# EAGLE design laser-tag (EAGLE 6.6.0)
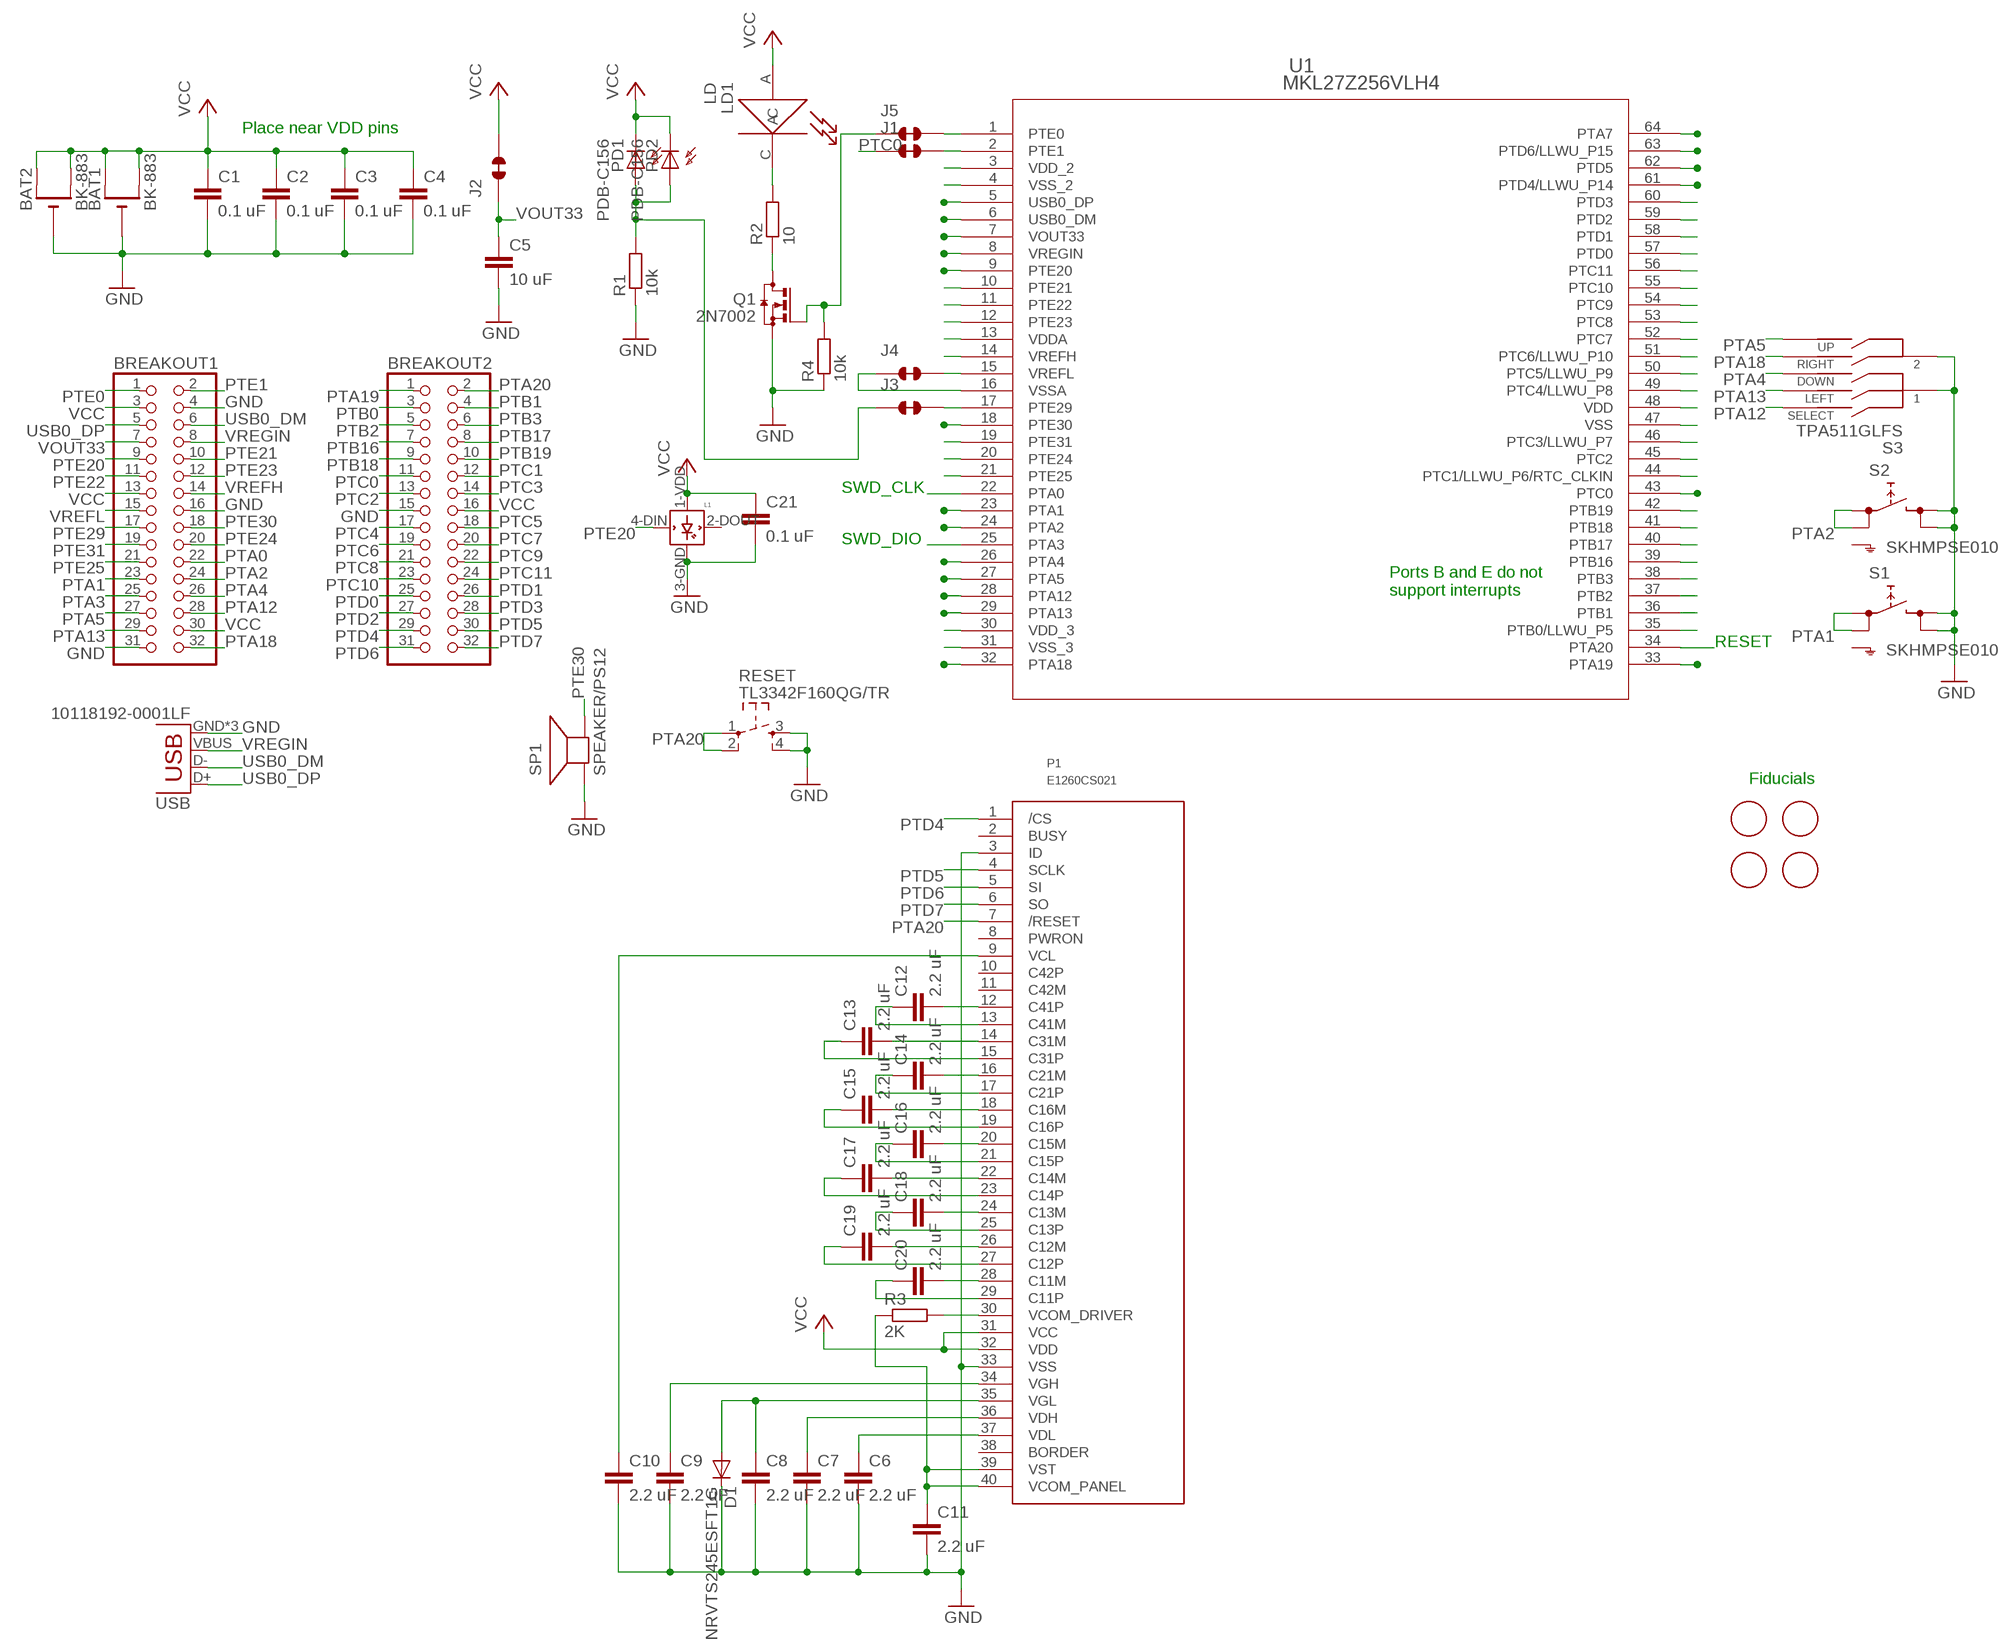
[diagram p0: schematic, sheet 1]

## Parts
BAT1  BK-883  CR2032SMT  [CR2032-SMD]
BAT2  BK-883  CR2032SMT  [CR2032-SMD]
BREAKOUT1  PINHD-2X16  [2X16]
BREAKOUT2  PINHD-2X16  [2X16]
C1  0.1 uF  C-EUC0603K  [C0603K]
C2  0.1 uF  C-EUC0603K  [C0603K]
C3  0.1 uF  C-EUC0603K  [C0603K]
C4  0.1 uF  C-EUC0603K  [C0603K]
C5  10 uF  C-EUC0603K  [C0603K]
C6  2.2 uF  C-EUC0603K  [C0603K]
C7  2.2 uF  C-EUC0603K  [C0603K]
C8  2.2 uF  C-EUC0603K  [C0603K]
C9  2.2 uF  C-EUC0603K  [C0603K]
C10  2.2 uF  C-EUC0603K  [C0603K]
C11  2.2 uF  C-EUC0603K  [C0603K]
C12  2.2 uF  C-EUC0603K  [C0603K]
C13  2.2 uF  C-EUC0603K  [C0603K]
C14  2.2 uF  C-EUC0603K  [C0603K]
C15  2.2 uF  C-EUC0603K  [C0603K]
C16  2.2 uF  C-EUC0603K  [C0603K]
C17  2.2 uF  C-EUC0603K  [C0603K]
C18  2.2 uF  C-EUC0603K  [C0603K]
C19  2.2 uF  C-EUC0603K  [C0603K]
C20  2.2 uF  C-EUC0603K  [C0603K]
C21  0.1 uF  C-EUC0603K  [C0603K]
D1  NRVTS245ESFT1G  CGRM4001-G  [SOD-123_MINI-SMA]
J1  JUMPER_SOLDER_1X2_CLOSED  [JUMPER_SOLDER_1X2_CLOSED]
J2  JUMPER_SOLDER_1X2_CLOSED  [JUMPER_SOLDER_1X2_CLOSED]
J3  JUMPER_SOLDER_1X2_CLOSED  [JUMPER_SOLDER_1X2_CLOSED]
J4  JUMPER_SOLDER_1X2_CLOSED  [JUMPER_SOLDER_1X2_CLOSED]
J5  JUMPER_SOLDER_1X2_CLOSED  [JUMPER_SOLDER_1X2_CLOSED]
L1  WS2812B  [WS2812B]
LD1  LD  [LD-FLUSH-WITH-JUMPER]
P1  E1260CS021  [E1260CS021_SLOT]
PD1  PDB-C156  [PDB-C156-FLUSH]
PD2  PDB-C156  [PDB-C156-FLUSH]
Q1  2N7002  BSS123  [SOT23]
R1  10k  R-EU_R0603  [R0603]
R2  10  R-EU_R0603  [R0603]
R3  2K  R-EU_R0603  [R0603]
R4  10k  R-EU_R0603  [R0603]
RESET  TL3342F160QG/TR  SW_TACT_4P  [SW_TACT_SMALL]
S1  SKHMPSE010  [SKHMPXE010]
S2  SKHMPSE010  [SKHMPXE010]
S3  TPA511GLFS  [TPA511GLFS]
SP1  SPEAKER/PS12  [PS12]
U1  MKL27Z256VLH4  [LQFP-64_10X10X1.6]
U$1  FIDUCIAL  [FIDUCIAL_1MM]
U$2  FIDUCIAL  [FIDUCIAL_1MM]
U$3  FIDUCIAL  [FIDUCIAL_1MM]
U$4  FIDUCIAL  [FIDUCIAL_1MM]
USB  10118192-0001LF  USB-MICROB  [USB-MICROB]

## Nets
GND: BAT1.- BAT2.- BREAKOUT1.4 BREAKOUT1.16 BREAKOUT1.31 BREAKOUT2.15 C1.2 C2.2 C3.2 C4.2 C5.2 C6.2 C7.2 C8.2 C9.2 C10.2 C11.2 C21.2 D1.C J4.1 L1.3-GND(GND) P1.3(ID) P1.33(VSS) Q1.2(S) R1.1 R4.1 RESET.3 RESET.4 S1.3(2.1) S1.4(2.2) S2.3(2.1) S2.4(2.2) S3.1 S3.2 SP1.P$1(+) U1.4(VSS_2) U1.16(VSSA) U1.31(VSS_3) U1.47(VSS) USB.GND USB.MT1(GND) USB.MT2(GND)
N$1: Q1.3(D) R2.1
N$2: C11.1 P1.39(VST) P1.40(VCOM_PANEL) R3.1
N$3: P1.30(VCOM_DRIVER) R3.2
N$4: C6.1 P1.37(VDL)
N$5: C7.1 P1.36(VDH)
N$6: C8.1 D1.A P1.35(VGL)
N$7: C9.1 P1.34(VGH)
N$8: C10.1 P1.9(VCL)
N$9: LD1.C R2.2
N$10: J5.1 Q1.1(G) R4.2
N$11: J3.1 PD1.A PD2.A R1.2
N$12: C12.2 P1.12(C41P)
N$13: C12.1 P1.13(C41M)
N$14: C13.2 P1.14(C31M)
N$15: C13.1 P1.15(C31P)
N$16: C14.2 P1.16(C21M)
N$17: C14.1 P1.17(C21P)
N$18: C15.2 P1.18(C16M)
N$19: C15.1 P1.19(C16P)
N$20: C16.2 P1.20(C15M)
N$21: C16.1 P1.21(C15P)
N$22: C17.2 P1.22(C14M)
N$23: C17.1 P1.23(C14P)
N$24: C18.2 P1.24(C13M)
N$25: C18.1 P1.25(C13P)
N$26: C19.2 P1.26(C12M)
N$27: C19.1 P1.27(C12P)
N$28: C20.2 P1.28(C11M)
N$29: C20.1 P1.29(C11P)
PTA0: BREAKOUT1.22 U1.22(PTA0)
PTA1: BREAKOUT1.23 S1.1(1.1) S1.2(1.2) U1.23(PTA1)
PTA2: BREAKOUT1.24 S2.1(1.1) S2.2(1.2) U1.24(PTA2)
PTA3: BREAKOUT1.25 U1.25(PTA3)
PTA4: BREAKOUT1.26 S3.4(DOWN) U1.26(PTA4)
PTA5: BREAKOUT1.27 S3.3(UP) U1.27(PTA5)
PTA12: BREAKOUT1.28 S3.5(SELECT) U1.28(PTA12)
PTA13: BREAKOUT1.29 S3.7(LEFT) U1.29(PTA13)
PTA18: BREAKOUT1.32 S3.6(RIGHT) U1.32(PTA18)
PTA19: BREAKOUT2.1 U1.33(PTA19)
PTA20: BREAKOUT2.2 P1.7(/RESET) RESET.1 RESET.2 U1.34(PTA20)
PTB0: BREAKOUT2.3 U1.35(PTB0/LLWU_P5)
PTB1: BREAKOUT2.4 U1.36(PTB1)
PTB2: BREAKOUT2.5 U1.37(PTB2)
PTB3: BREAKOUT2.6 U1.38(PTB3)
PTB16: BREAKOUT2.7 U1.39(PTB16)
PTB17: BREAKOUT2.8 U1.40(PTB17)
PTB18: BREAKOUT2.9 U1.41(PTB18)
PTB19: BREAKOUT2.10 U1.42(PTB19)
PTC0: BREAKOUT2.11 J1.1 U1.43(PTC0)
PTC1: BREAKOUT2.12 U1.44(PTC1/LLWU_P6/RTC_CLKIN)
PTC2: BREAKOUT2.13 U1.45(PTC2)
PTC3: BREAKOUT2.14 U1.46(PTC3/LLWU_P7)
PTC4: BREAKOUT2.17 U1.49(PTC4/LLWU_P8)
PTC5: BREAKOUT2.18 U1.50(PTC5/LLWU_P9)
PTC6: BREAKOUT2.19 U1.51(PTC6/LLWU_P10)
PTC7: BREAKOUT2.20 U1.52(PTC7)
PTC8: BREAKOUT2.21 U1.53(PTC8)
PTC9: BREAKOUT2.22 U1.54(PTC9)
PTC10: BREAKOUT2.23 U1.55(PTC10)
PTC11: BREAKOUT2.24 U1.56(PTC11)
PTD0: BREAKOUT2.25 U1.57(PTD0)
PTD1: BREAKOUT2.26 U1.58(PTD1)
PTD2: BREAKOUT2.27 U1.59(PTD2)
PTD3: BREAKOUT2.28 U1.60(PTD3)
PTD4: BREAKOUT2.29 P1.1(/CS) U1.61(PTD4/LLWU_P14)
PTD5: BREAKOUT2.30 P1.4(SCLK) U1.62(PTD5)
PTD6: BREAKOUT2.31 P1.5(SI) U1.63(PTD6/LLWU_P15)
PTD7: BREAKOUT2.32 P1.6(SO) U1.64(PTA7)
PTE0: BREAKOUT1.1 J5.2 U1.1(PTE0)
PTE1: BREAKOUT1.2 J1.2 U1.2(PTE1)
PTE20: BREAKOUT1.9 L1.4-DIN(DIN) U1.9(PTE20)
PTE21: BREAKOUT1.10 U1.10(PTE21)
PTE22: BREAKOUT1.11 U1.11(PTE22)
PTE23: BREAKOUT1.12 U1.12(PTE23)
PTE24: BREAKOUT1.20 U1.20(PTE24)
PTE25: BREAKOUT1.21 U1.21(PTE25)
PTE29: BREAKOUT1.17 J3.2 U1.17(PTE29)
PTE30: BREAKOUT1.18 SP1.P$2(-) U1.18(PTE30)
PTE31: BREAKOUT1.19 U1.19(PTE31)
USB0_DM: BREAKOUT1.6 U1.6(USB0_DM) USB.D-
USB0_DP: BREAKOUT1.5 U1.5(USB0_DP) USB.D+
VCC: BAT1.+$1(+) BAT1.+$2(+1) BAT2.+$1(+) BAT2.+$2(+1) BREAKOUT1.3 BREAKOUT1.13 BREAKOUT1.30 BREAKOUT2.16 C1.1 C2.1 C3.1 C4.1 C21.1 J2.2 L1.1-VDD(VDD) LD1.A P1.31(VCC) P1.32(VDD) PD1.C PD2.C U1.3(VDD_2) U1.13(VDDA) U1.30(VDD_3) U1.48(VDD)
VOUT33: BREAKOUT1.7 C5.1 J2.1 U1.7(VOUT33)
VREFH: BREAKOUT1.14 U1.14(VREFH)
VREFL: BREAKOUT1.15 J4.2 U1.15(VREFL)
VREGIN: BREAKOUT1.8 U1.8(VREGIN) USB.VBUS
Unconnected: L1.2-DOUT(DOUT) P1.2(BUSY) P1.8(PWRON) P1.10(C42P) P1.11(C42M) P1.38(BORDER) S1.5(SH) S2.5(SH)

## Notes on the sheet
- Place near VDD pins
- SWD_CLK
- SWD_DIO
- Ports B and E do not
  support interrupts
- RESET
- Fiducials

## Library data of the parts
BAT1 BAT2 = adafruit:CR2032
BREAKOUT1 BREAKOUT2 = pinhead:PINHD-2X16: PIN HEADER
C1-C21 = rcl:C-EU: CAPACITOR, European symbol
D1 = diode:CGRM400*-G: Molded plasitc,JEDEC SOD-123/Mini SMA Source: Comchip CGRM4001-G.pdf
J1-J5 = Jumpers:JUMPER_SOLDER_1X2_CLOSED
L1 = adafruit:WS2812B
LD1 = Photonics:LD
P1 = Displays:E1260CS021
PD1 PD2 = Photonics:PDB-C156
Q1 = transistor-small-signal:BSS123: N-CHANNEL MOS FET
R1-R4 = rcl:R-EU_: RESISTOR, European symbol
RESET = dp_devices.v6:SW_TACT_4P
S1 S2 = switch:SKHMP*E010: 6.2 X 6.5mm TACT Switch (SMD) Source: http://www3.alps.co.jp/WebObjects/catalog.woa/PDF/E/Switch/Tact/SKHM/SKHM.PDF
S3 = Switches:TPA511GLFS
SP1 = adafruit:SPEAKER: SPEAKER Source: Buerklin Added PS12 (for part # PS1240 piezo) http://www.ladyada.net/library/pcb/eaglelibrary.html
U1 = Freescale:MKL27Z256VLH4; CPU: ARM Cortex-M0+; FLASHKB: 256; MANUFACTURER_PART_NUMBER: mkl27z256vlh4; MAXFREQUENCY: 48; PACKAGE: LQFP; PINCOUNT: 64; SRAMKB: 32; VENDOR: FREESCALE
U$1-U$4 = adafruit:FIDUCIAL: For use by pick and place machines to calibrate the vision/machine, 1mm By microbuilder.eu
USB = SparkFun-Connectors:USB: USB Connectors USB-B-PTH is fully proven SKU : PRT-00139/CONN-08278 USB-miniB is fully proven SKU : PRT-00587 USB-A-PCB is untested. USB-A-H is throughly reviewed, but untested. Spark Fun Electronics SKU : PRT-00437 USB-B-SMT is throughly reviewed, but untested. Needs silkscreen touching up. USB-A-S has not been used/tested USB-MB-H has not been used/tested USB-MICROB has been used. CONN-09505; PROD_ID: CONN-09505

## Board
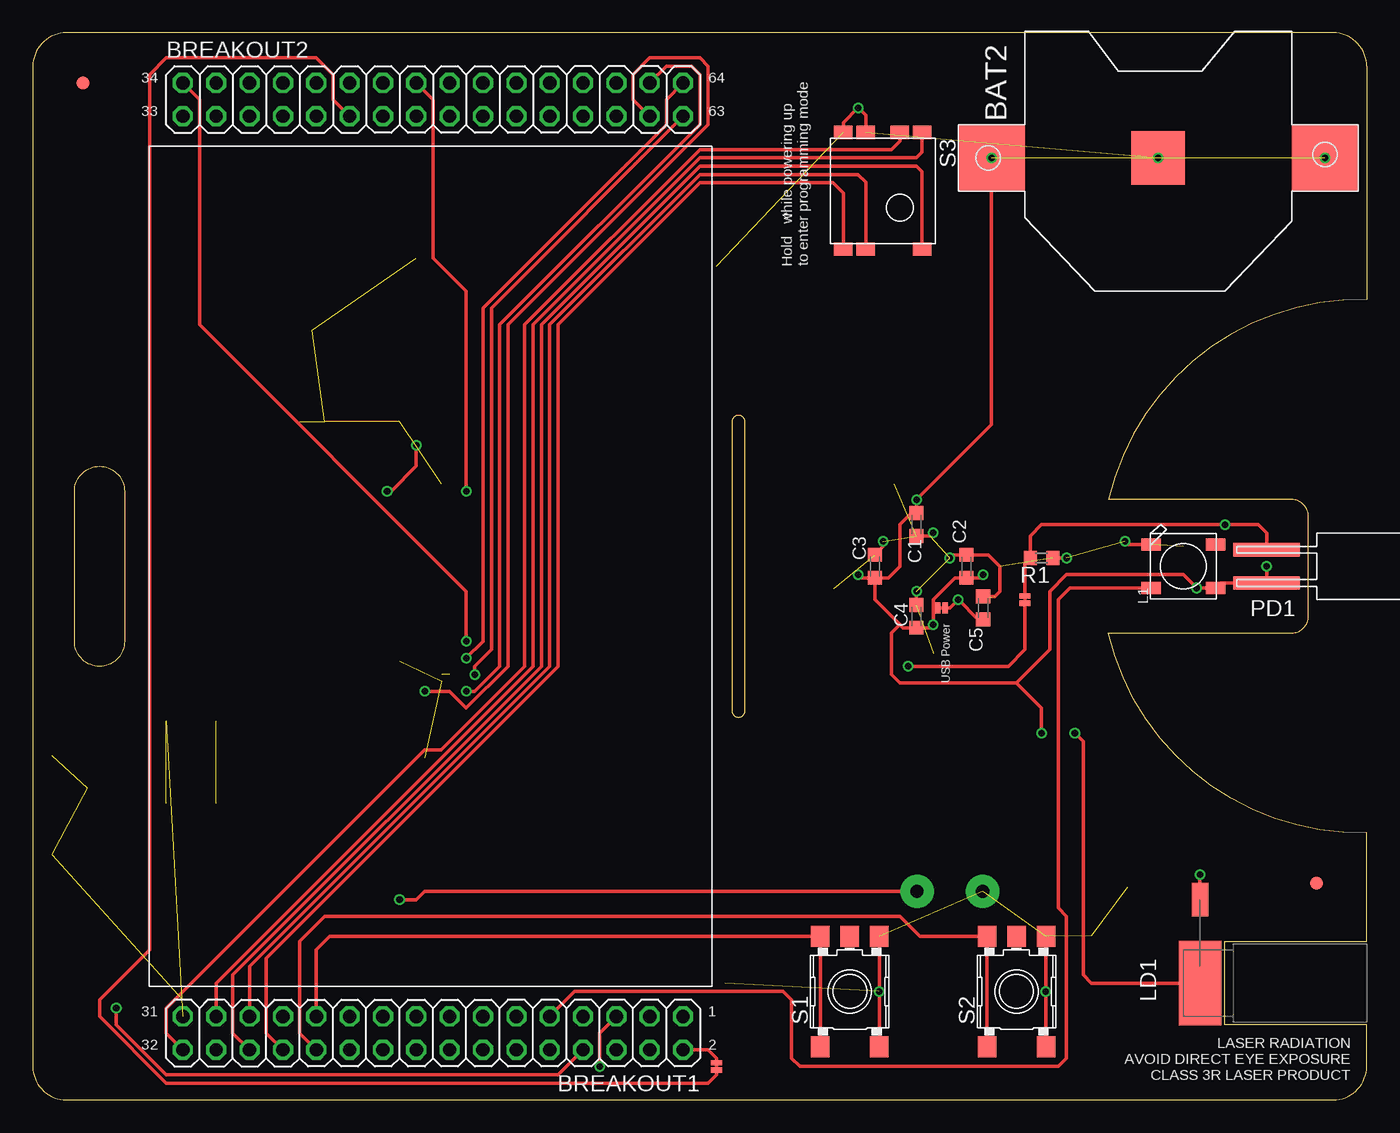
[diagram p1: board, top side]
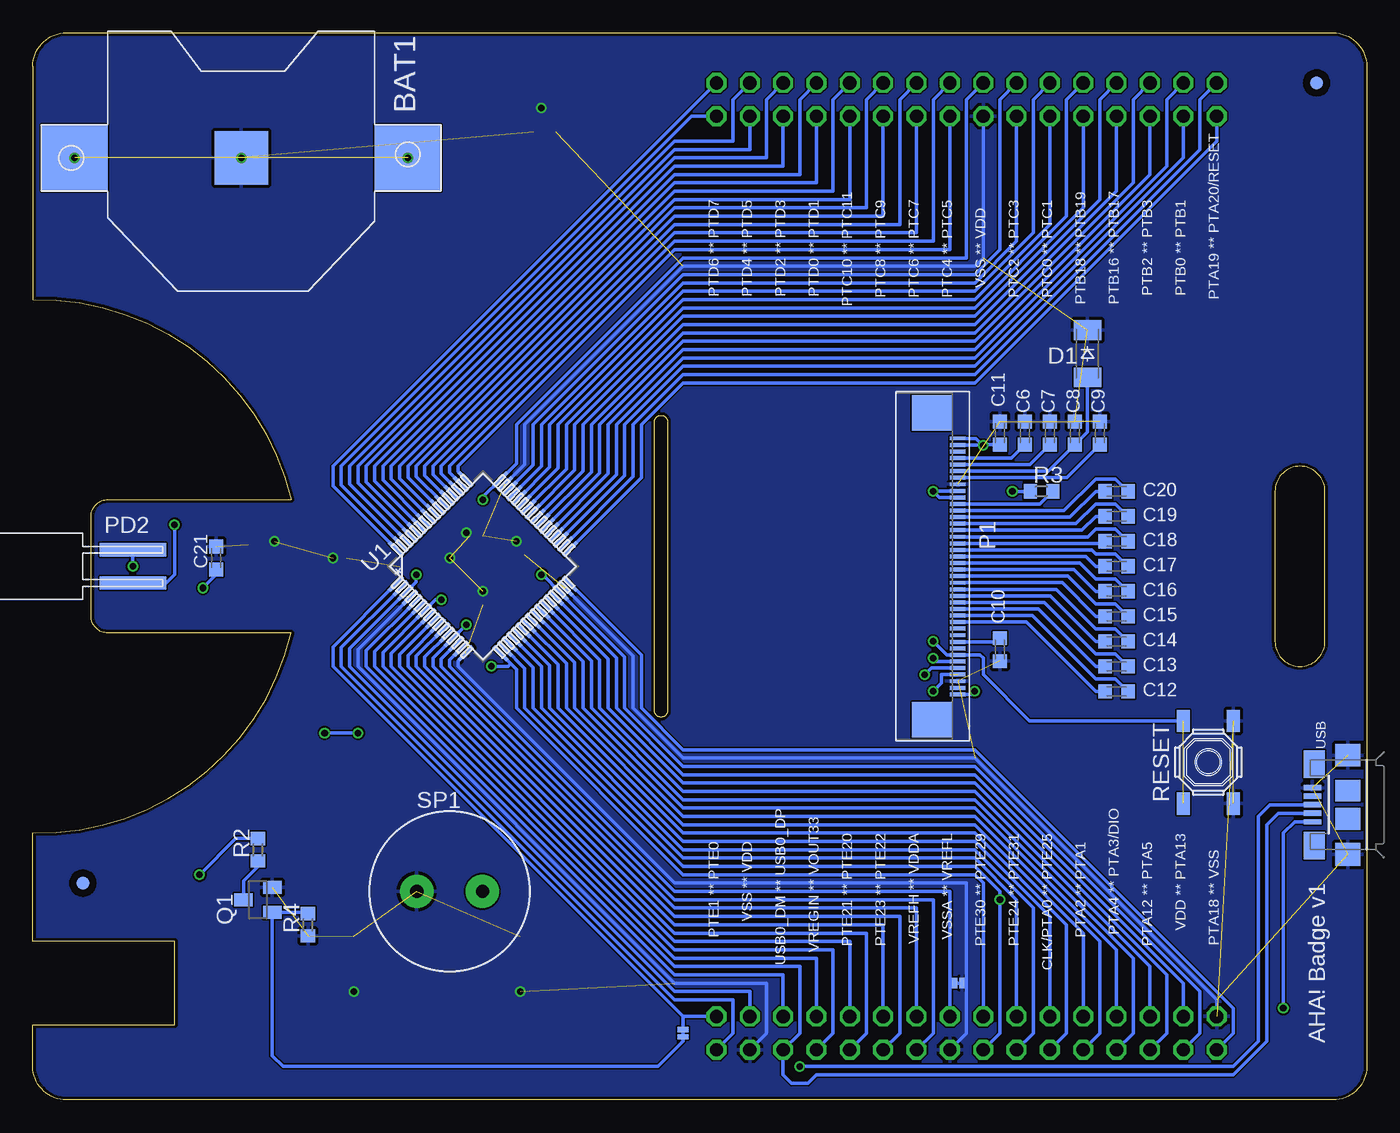
[diagram p2: board, bottom side, seen from below]

Size 101.6 x 81.28 mm. Coordinates in mm from the lower left corner, seen from the top.
Outline: 101.6,78.74 101.6,60.96 arc78 81.92,45.72 95.89,45.72 arc-90 97.16,44.45 97.16,36.83 arc-90 95.89,35.56 81.92,35.56 arc78 101.6,20.32 101.6,12.06 90.81,12.06 90.81,5.71 101.6,5.71 101.6,2.54 arc-90 99.06,0 2.54,0 arc-90 0,2.54 0,78.74 arc-90 2.54,81.28 99.06,81.28 arc-90 101.6,78.74
Outline: 3.17,34.92 3.17,46.35 arc-90 5.08,48.26 arc-90 6.99,46.35 6.99,34.92 arc-90 5.08,33.02 arc-90 3.17,34.92
Copper layers (1*16): Top 0.035mm / dielectric 1.5mm / Bottom 0.035mm
Design rules "dirt_cheap_dirty_boards.v1": minimum track width 5mil, minimum drill 12mil, track to track 5mil, track to pad 5mil, pad to pad 5mil, via to via 5mil, smd to smd 0mil, copper to edge 10mil, drill to drill 10mil, minimum pad ring 10mil, minimum via ring 6mil, stop-mask expansion 2mil, vias tented up to drill 25mil, thermal gap 10mil

### Footprints (pad centres in the part's own frame; a part is rotated, then mirrored left to right if it is on the bottom)
CR2032-SMD = smd 5.08 x 5.08: +$1 -12.7,0; +$2 12.7,0 | smd 4.064 x 4.064: - 0,0
2X16 = drill 1.016 octagon: 1 -19.05,-1.27; 2 -19.05,1.27; 3 -16.51,-1.27; 4 -16.51,1.27; 5 -13.97,-1.27; 6 -13.97,1.27; 7 -11.43,-1.27; 8 -11.43,1.27; 9 -8.89,-1.27; 10 -8.89,1.27; 11 -6.35,-1.27; 12 -6.35,1.27; 13 -3.81,-1.27; 14 -3.81,1.27; 15 -1.27,-1.27; 16 -1.27,1.27; 17 1.27,-1.27; 18 1.27,1.27; 19 3.81,-1.27; 20 3.81,1.27; 21 6.35,-1.27; 22 6.35,1.27; 23 8.89,-1.27; 24 8.89,1.27; 25 11.43,-1.27; 26 11.43,1.27; 27 13.97,-1.27; 28 13.97,1.27; 29 16.51,-1.27; 30 16.51,1.27; 31 19.05,-1.27; 32 19.05,1.27
C0603K = smd 1.05 x 1.08: 1 -0.875,0; 2 0.875,0
SOD-123_MINI-SMA = smd 1.5 x 2.1: A 1.8,0; C -1.8,0
JUMPER_SOLDER_1X2_CLOSED = smd 0.406 x 0.813: 1 -0.279,0; 2 0.279,0
WS2812B = smd 1.5 x 0.9: 1-VDD 2.45,-1.65; 2-DOUT 2.45,1.65; 3-GND -2.45,1.65; 4-DIN -2.45,-1.65
LD-FLUSH-WITH-JUMPER = smd 6.452 x 3.251: A 0,0 | smd 2.54 x 1.27: C 6.35,0
E1260CS021_SLOT = smd 0.3 x 1.2: 1 9.75,0.6; 2 9.25,0.6; 3 8.75,0.6; 4 8.25,0.6; 5 7.75,0.6; 6 7.25,0.6; 7 6.75,0.6; 8 6.25,0.6; 9 5.75,0.6; 10 5.25,0.6; 11 4.75,0.6; 12 4.25,0.6; 13 3.75,0.6; 14 3.25,0.6; 15 2.75,0.6; 16 2.25,0.6; 17 1.75,0.6; 18 1.25,0.6; 19 0.75,0.6; 20 0.25,0.6; 21 -0.25,0.6; 22 -0.75,0.6; 23 -1.25,0.6; 24 -1.75,0.6; 25 -2.25,0.6; 26 -2.75,0.6; 27 -3.25,0.6; 28 -3.75,0.6; 29 -4.25,0.6; 30 -4.75,0.6; 31 -5.25,0.6; 32 -5.75,0.6; 33 -6.25,0.6; 34 -6.75,0.6; 35 -7.25,0.6; 36 -7.75,0.6; 37 -8.25,0.6; 38 -8.75,0.6; 39 -9.25,0.6; 40 -9.75,0.6 | smd 2.7 x 3: Z1 -11.68,-1.38; Z2 11.68,-1.38
PDB-C156-FLUSH = smd 1.016 x 5.08: A -1.27,0; C 1.27,0
SOT23 = smd 1 x 1.4: 1 -0.95,-1.1; 2 0.95,-1.1; 3 0,1.1
R0603 = smd 1 x 1.1: 1 -0.85,0; 2 0.85,0
SW_TACT_SMALL = smd 1.7 x 1: 1 -3.15,1.9; 2 3.15,1.9; 3 -3.15,-1.9; 4 3.15,-1.9
SKHMPXE010 = smd 1.6 x 1.4: 1 -4.2,2.25; 2 4.2,2.25; 3 -4.2,-2.25; 4 4.2,-2.25; 5 4.2,0
TPA511GLFS = smd 1 x 1.4: 1 -5.75,-4.3; 2 -5.75,-2.6; 3 3.15,-2.6; 4 3.15,-4.3; 5 3.15,1.7; 6 -5.75,0; 7 -5.75,1.7
PS12 = drill 1 pad 2.54: P$1 -2.5,0; P$2 2.5,0
LQFP-64_10X10X1.6 = smd 1.473 x 0.279: 1 -5.625,3.75; 2 -5.625,3.25; 3 -5.625,2.75; 4 -5.625,2.25; 5 -5.625,1.75; 6 -5.625,1.25; 7 -5.625,0.75; 8 -5.625,0.25; 9 -5.625,-0.25; 10 -5.625,-0.75; 11 -5.625,-1.25; 12 -5.625,-1.75; 13 -5.625,-2.25; 14 -5.625,-2.75; 15 -5.625,-3.25; 16 -5.625,-3.75; 33 5.625,-3.75; 34 5.625,-3.25; 35 5.625,-2.75; 36 5.625,-2.25; 37 5.625,-1.75; 38 5.625,-1.25; 39 5.625,-0.75; 40 5.625,-0.25; 41 5.625,0.25; 42 5.625,0.75; 43 5.625,1.25; 44 5.625,1.75; 45 5.625,2.25; 46 5.625,2.75; 47 5.625,3.25; 48 5.625,3.75 | smd 0.279 x 1.473: 17 -3.75,-5.625; 18 -3.25,-5.625; 19 -2.75,-5.625; 20 -2.25,-5.625; 21 -1.75,-5.625; 22 -1.25,-5.625; 23 -0.75,-5.625; 24 -0.25,-5.625; 25 0.25,-5.625; 26 0.75,-5.625; 27 1.25,-5.625; 28 1.75,-5.625; 29 2.25,-5.625; 30 2.75,-5.625; 31 3.25,-5.625; 32 3.75,-5.625; 49 3.75,5.625; 50 3.25,5.625; 51 2.75,5.625; 52 2.25,5.625; 53 1.75,5.625; 54 1.25,5.625; 55 0.75,5.625; 56 0.25,5.625; 57 -0.25,5.625; 58 -0.75,5.625; 59 -1.25,5.625; 60 -1.75,5.625; 61 -2.25,5.625; 62 -2.75,5.625; 63 -3.25,5.625; 64 -3.75,5.625
FIDUCIAL_1MM = smd 1 x 1: 1 0,0
USB-MICROB = smd 0.4 x 1.35: D+ 0,2.675; D- -0.65,2.675; GND 1.3,2.675; ID 0.65,2.675; VBUS -1.3,2.675 | smd 1.75 x 1.9: MT1 -3.775,0; MT2 3.775,0 | smd 2.1 x 1.6: MT3 3.1,2.55; MT4 -3.1,2.55 | smd 1.65 x 1.9: P$1 -1.075,0; P$2 1.075,0

### Placement (x,y rotation side)
BAT1  85.72,71.75 0 bottom
BAT2  85.72,71.75 0 top
BREAKOUT1  30.48,5.08 180 top
BREAKOUT2  30.48,76.2 0 top
C1  67.31,43.81 270 top
C2  71.12,40.64 90 top
C3  64.14,40.64 90 top
C4  67.31,36.83 90 top
C5  72.39,37.47 90 top
C6  26.04,50.8 90 bottom
C7  24.13,50.8 90 bottom
C8  22.23,50.8 90 bottom
C9  20.32,50.8 90 bottom
C10  27.94,34.29 270 bottom
C11  27.94,50.8 90 bottom
C12  19.05,31.11 180 bottom
C13  19.05,33.02 180 bottom
C14  19.05,34.92 180 bottom
C15  19.05,36.83 180 bottom
C16  19.05,38.73 180 bottom
C17  19.05,40.64 180 bottom
C18  19.05,42.55 180 bottom
C19  19.05,44.45 180 bottom
C20  19.05,46.35 180 bottom
C21  87.63,41.27 90 bottom
D1  21.27,56.83 270 bottom
J1  52.07,2.54 90 top
J2  69.22,37.47 180 top
J3  75.56,38.1 270 top
J4  31.11,8.89 180 bottom
J5  52.07,5.08 90 bottom
L1  87.63,40.64 0 top
LD1  88.9,8.89 90 top
P1  31.75,40.64 270 bottom
PD1  93.98,40.64 270 top
PD2  93.98,40.64 90 bottom
Q1  84.45,15.24 90 bottom
R1  76.83,41.27 180 top
R2  84.45,19.05 90 bottom
R3  24.77,46.35 0 bottom
R4  80.64,13.34 90 bottom
RESET  12.06,25.72 90 bottom
S1  62.23,8.26 90 top
S2  74.93,8.26 90 top
S3  66.04,67.94 270 top
SP1  69.85,15.88 0 bottom
U1  67.31,40.64 45 bottom
U$1  97.79,16.51 0 top
U$2  3.81,77.47 0 top
U$3  3.81,77.47 0 bottom
U$4  97.79,16.51 0 bottom
USB  1.45,22.48 90 bottom

### Tracks (layer width: path | path; a pad name or v marks a point on that pad's centre or on a via)
GND  (via drill 0.5)  (31 unrouted)
  Top 0.254: S2.3 77.18,8.23 v77.15,8.26 77.18,8.28 S2.4 | S1.4 64.48,8.28 v64.45,8.26 64.48,8.23 S1.3 | S3.1 61.74,74.44 v62.87,75.56 63.44,74.99 S3.2 | L1.3-GND 83.44,42.29 v83.19,42.55 | R1.1 v78.74,41.27 | v68.58,43.18 68.34,42.94 C1.2 | C4.2 v67.31,38.73 | v69.85,41.27 70.09,41.52 C2.2 72.78,41.52 73.66,40.64 73.66,38.73 73.27,38.34 C5.2 | C3.2 64.77,42.15 v64.77,42.55
  Bottom 0.254: U1.31 55.88,33.81 55.88,29.84 52.07,26.04 29.84,26.04 11.43,7.62 BREAKOUT1.31 | U1.47 64.14,48.41 64.14,51.44 52.07,63.5 29.84,63.5 29.21,64.14 BREAKOUT2.15 | U1.16 69.22,33.43 69.22,33.02 52.7,16.51 30.48,16.51 30.48,8.89 | 30.48,8.89 30.48,5.08 BREAKOUT1.16 | U1.4 76.83,34.3 76.83,33.02 52.7,8.89 45.72,8.89 45.72,5.08 BREAKOUT1.4 | J4.1 30.48,8.89
  other vias: 85.72,71.75
  pour Bottom: 101.6,0 101.6,81.28 0,81.28 0,0
N$1
  Bottom 0.254: R2.1 84.45,17.78 85.56,16.68 Q1.3
N$2  (via drill 0.5)
  Top 0.254: v29.21,49.85 29.21,48.26 27.3,46.35 v26.99,46.35
  Bottom 0.254: P1.39 29.25,49.89 v29.21,49.85 | P1.40 29.75,50.39 v29.21,49.85 | C11.1 29.13,49.92 v29.21,49.85 | R3.1 v26.99,46.35
N$3
  Bottom 0.254: P1.30 24.88,45.39 R3.2
N$4
  Bottom 0.254: P1.37 27.07,48.89 C6.1
N$5
  Bottom 0.254: P1.36 25.66,48.39 C7.1
N$6
  Bottom 0.254: P1.35 24.26,47.89 C8.1 21.27,50.88 D1.A
N$7
  Bottom 0.254: P1.34 22.86,47.39 C9.1
N$8
  Bottom 0.254: P1.9 28.21,34.89 C10.1
N$9  (via drill 0.5)
  Top 0.254: LD1.C v88.9,17.14
  Bottom 0.254: v88.9,17.14 86.14,19.9 R2.2
N$10
  Bottom 0.254: J5.1 52.07,4.45 53.98,2.54 82.55,2.54 83.36,3.35 Q1.1 80.75,14.29 R4.2 80.64,14.29
N$11  (via drill 0.5)
  Top 0.254: PD1.A 93.98,43.18 93.34,43.81 v90.81,43.81 76.83,43.81 75.98,42.97 R1.2 75.56,40.85 J3.1
  Bottom 0.254: PD2.A 91.44,39.37 90.81,40.01 v90.81,43.81
N$12
  Bottom 0.254: P1.12 25.91,36.39 20.64,31.11 C12.2
N$13
  Bottom 0.254: P1.13 25.46,36.89 20.64,32.07 19.13,32.07 C12.1
N$14
  Bottom 0.254: P1.14 25.01,37.39 20.64,33.02 C13.2
N$15
  Bottom 0.254: P1.15 24.55,37.89 20.64,33.97 19.13,33.97 C13.1
N$16
  Bottom 0.254: C14.2 20.64,34.92 24.1,38.39 P1.16
N$17
  Bottom 0.254: C14.1 19.13,35.88 20.64,35.88 23.65,38.89 P1.17
N$18
  Bottom 0.254: C15.2 20.64,36.83 23.2,39.39 P1.18
N$19
  Bottom 0.254: C15.1 19.13,37.78 20.64,37.78 22.75,39.89 P1.19
N$20
  Bottom 0.254: C16.2 20.64,38.73 22.29,40.39 P1.20
N$21
  Bottom 0.254: C16.1 19.13,39.69 20.64,39.69 21.84,40.89 P1.21
N$22
  Bottom 0.254: C17.2 20.64,40.64 21.39,41.39 P1.22
N$23
  Bottom 0.254: C17.1 19.13,41.59 20.64,41.59 20.93,41.89 P1.23
N$24
  Bottom 0.254: P1.24 20.08,42.39 C18.2
N$25
  Bottom 0.254: C18.1 19.13,43.5 20.64,43.5 21.25,42.89 P1.25
N$26
  Bottom 0.254: C19.2 20.64,44.45 21.7,43.39 P1.26
N$27
  Bottom 0.254: C19.1 19.13,45.4 20.64,45.4 22.15,43.89 P1.27
N$28
  Bottom 0.254: P1.28 22.6,44.39 20.64,46.35 C20.2
N$29
  Bottom 0.254: P1.29 23.05,44.89 20.64,47.31 19.13,47.31 C20.1
PTA0
  Bottom 0.254: BREAKOUT1.22 22.86,5.08 22.86,13.34 29.84,20.32 52.07,20.32 61.59,29.84 61.59,33.16 U1.22
PTA1
  Top 0.254: S1.1 S1.2 22.61,12.46 21.59,11.43 BREAKOUT1.23
  Bottom 0.254: U1.23 60.96,33.23 60.96,29.84 52.07,20.95 29.84,20.95 21.59,12.7 BREAKOUT1.23
PTA2
  Top 0.254: S2.1 S2.2 67.56,12.46 66.04,13.97 22.23,13.97 20.32,12.06 20.32,5.08 BREAKOUT1.24
  Bottom 0.254: BREAKOUT1.24 20.32,5.08 20.32,12.06 29.84,21.59 52.07,21.59 60.33,29.84 60.33,33.3 U1.24
PTA3
  Bottom 0.254: U1.25 59.69,33.37 59.69,29.84 52.07,22.23 29.84,22.23 19.05,11.43 BREAKOUT1.25
PTA4
  Top 0.254: BREAKOUT1.26 17.78,5.08 17.78,10.79 40.01,33.02 40.01,59.05 50.8,69.85 60.96,69.85 61.74,69.07 S3.4
  Bottom 0.254: BREAKOUT1.26 17.78,5.08 17.78,10.79 29.84,22.86 52.07,22.86 59.05,29.84 59.05,33.45 U1.26
PTA5
  Top 0.254: BREAKOUT1.27 16.51,10.16 39.37,33.02 39.37,59.05 50.8,70.48 62.87,70.48 63.44,69.91 S3.3
  Bottom 0.254: U1.27 58.42,33.52 58.42,29.84 52.07,23.5 29.84,23.5 16.51,10.16 BREAKOUT1.27
PTA12
  Top 0.254: BREAKOUT1.28 15.24,5.08 15.24,9.53 38.73,33.02 38.73,59.05 50.8,71.12 67.31,71.12 67.74,70.69 S3.5
  Bottom 0.254: BREAKOUT1.28 15.24,5.08 15.24,9.53 29.84,24.13 52.07,24.13 57.78,29.84 57.78,33.59 U1.28
PTA13
  Top 0.254: BREAKOUT1.29 13.97,8.89 38.1,33.02 38.1,59.05 50.8,71.75 67.31,71.75 67.74,72.19 S3.7
  Bottom 0.254: U1.29 57.15,33.66 57.15,29.84 52.07,24.77 29.84,24.77 13.97,8.89 BREAKOUT1.29
PTA18
  Top 0.254: BREAKOUT1.32 10.16,5.08 10.16,6.99 29.84,26.67 31.11,26.67 37.47,33.02 37.47,59.05 50.8,72.39 65.41,72.39 66.04,73.03 S3.6
  Bottom 0.254: BREAKOUT1.32 10.16,5.08 10.16,6.99 29.84,26.67 52.07,26.67 55.24,29.84 55.24,33.88 U1.32
PTA19
  Bottom 0.254: U1.33 55.24,47.4 55.24,51.44 52.07,54.61 29.84,54.61 11.43,73.03 BREAKOUT2.1
PTA20  (via drill 0.5)  (1 unrouted)
  Top 0.254: v33.02,34.92 33.02,38.73 12.7,59.05 12.7,76.2 BREAKOUT2.2
  Bottom 0.254: U1.34 55.88,47.47 55.88,51.44 52.07,55.24 29.84,55.24 12.7,72.39 12.7,76.2 BREAKOUT2.2 | v33.02,34.92 31.98,33.89 P1.7 29.45,33.89 29.21,33.66 29.21,32.38 25.69,28.87 RESET.2
PTB0
  Bottom 0.254: U1.35 56.52,47.55 56.52,51.44 52.07,55.88 29.84,55.88 13.97,71.75 BREAKOUT2.3
PTB1
  Bottom 0.254: U1.36 57.15,47.62 57.15,51.44 52.07,56.52 29.84,56.52 15.24,71.12 15.24,76.2 BREAKOUT2.4
PTB2
  Bottom 0.254: U1.37 57.78,47.69 57.78,51.44 52.07,57.15 29.84,57.15 16.51,70.48 BREAKOUT2.5
PTB3
  Bottom 0.254: U1.38 58.42,47.76 58.42,51.44 52.07,57.78 29.84,57.78 17.78,69.85 17.78,76.2 BREAKOUT2.6
PTB16
  Bottom 0.254: U1.39 59.05,47.83 59.05,51.44 52.07,58.42 29.84,58.42 19.05,69.22 BREAKOUT2.7
PTB17
  Bottom 0.254: U1.40 59.69,47.91 59.69,51.44 52.07,59.05 29.84,59.05 20.32,68.58 20.32,76.2 BREAKOUT2.8
PTB18
  Bottom 0.254: U1.41 60.33,47.98 60.33,51.44 52.07,59.69 29.84,59.69 21.59,67.94 BREAKOUT2.9
PTB19
  Bottom 0.254: U1.42 60.96,48.05 60.96,51.44 52.07,60.33 29.84,60.33 22.86,67.31 22.86,76.2 BREAKOUT2.10
PTC0
  Top 0.254: BREAKOUT2.11 22.86,76.2 22.86,78.11 21.59,79.38 10.16,79.38 8.89,78.11 8.89,11.43 5.08,7.62 5.08,6.35 10.16,1.27 51.44,1.27 52.07,1.91 J1.1
  Bottom 0.254: U1.43 61.59,48.12 61.59,51.44 52.07,60.96 29.84,60.96 24.13,66.67 BREAKOUT2.11
PTC1
  Bottom 0.254: U1.44 62.23,48.2 62.23,51.44 52.07,61.59 29.84,61.59 25.4,66.04 25.4,76.2 BREAKOUT2.12
PTC2
  Bottom 0.254: U1.45 62.87,48.27 62.87,51.44 52.07,62.23 29.84,62.23 26.67,65.41 BREAKOUT2.13
PTC3
  Bottom 0.254: U1.46 63.5,48.34 63.5,51.44 52.07,62.87 29.84,62.87 27.94,64.77 27.94,76.2 BREAKOUT2.14
PTC4
  Bottom 0.254: U1.49 69.22,47.85 69.22,48.26 52.7,64.77 31.75,64.77 BREAKOUT2.17
PTC5
  Bottom 0.254: U1.50 69.85,47.78 69.85,48.26 52.7,65.41 33.02,65.41 33.02,76.2 BREAKOUT2.18
PTC6
  Bottom 0.254: U1.51 70.48,47.7 70.48,48.26 52.7,66.04 34.29,66.04 BREAKOUT2.19
PTC7
  Bottom 0.254: U1.52 71.12,47.63 71.12,48.26 52.7,66.67 35.56,66.67 35.56,76.2 BREAKOUT2.20
PTC8
  Bottom 0.254: U1.53 71.75,47.56 71.75,48.26 52.7,67.31 36.83,67.31 BREAKOUT2.21
PTC9
  Bottom 0.254: U1.54 72.39,47.49 72.39,48.26 52.7,67.94 38.1,67.94 38.1,76.2 BREAKOUT2.22
PTC10
  Bottom 0.254: U1.55 73.03,47.42 73.03,48.26 52.7,68.58 39.37,68.58 BREAKOUT2.23
PTC11
  Bottom 0.254: U1.56 73.66,47.34 73.66,48.26 52.7,69.22 40.64,69.22 40.64,76.2 BREAKOUT2.24
PTD0
  Bottom 0.254: U1.57 74.3,47.27 74.3,48.26 52.7,69.85 41.91,69.85 BREAKOUT2.25
PTD1
  Bottom 0.254: U1.58 74.93,47.2 74.93,48.26 52.7,70.48 43.18,70.48 43.18,76.2 BREAKOUT2.26
PTD2
  Bottom 0.254: U1.59 75.56,47.13 75.56,48.26 52.7,71.12 44.45,71.12 BREAKOUT2.27
PTD3
  Bottom 0.254: U1.60 76.2,47.05 76.2,48.26 52.7,71.75 45.72,71.75 45.72,76.2 BREAKOUT2.28
PTD4  (via drill 0.5)
  Top 0.254: v29.84,31.11 31.75,31.11 33.02,29.84 36.2,33.02 36.2,59.05 51.44,74.3 51.44,78.74 50.8,79.38 46.99,79.38 45.72,78.11 45.72,76.2 BREAKOUT2.29
  Bottom 0.254: U1.61 76.83,46.98 76.83,48.26 52.7,72.39 46.99,72.39 BREAKOUT2.29 | P1.1 30.07,30.89 v29.84,31.11
PTD5  (via drill 0.5)  (1 unrouted)
  Top 0.254: BREAKOUT2.30 48.26,78.74 50.16,78.74 50.8,78.11 50.8,74.3 35.56,59.05 35.56,33.02 33.66,31.11 v33.02,31.11
  Bottom 0.254: U1.62 77.47,46.91 77.47,48.26 52.7,73.03 48.26,73.03 48.26,76.2 BREAKOUT2.30 | 31.75,32.39 32.38,32.39 32.38,31.75 v33.02,31.11
PTD6  (via drill 0.5)
  Top 0.254: BREAKOUT2.31 34.92,60.33 34.92,34.29 33.66,33.02 v33.66,32.38
  Bottom 0.254: U1.63 78.11,46.84 78.11,48.26 51.44,74.93 BREAKOUT2.31 | P1.5 33.15,32.89 v33.66,32.38
PTD7  (via drill 0.5)
  Top 0.254: v33.02,33.66 34.29,34.92 34.29,60.33 48.26,74.3 48.26,76.2 BREAKOUT2.32
  Bottom 0.254: U1.64 78.74,46.77 78.74,48.26 BREAKOUT2.32 | P1.6 32.76,33.39 v33.02,33.66
PTE0
  Bottom 0.254: 52.07,6.35 78.74,33.02 78.74,34.51 U1.1 | 52.07,6.35 BREAKOUT1.1 | 52.07,6.35 J5.2
PTE1
  Top 0.254: BREAKOUT1.2 51.44,3.81 52.07,3.17 J1.2
  Bottom 0.254: U1.2 78.11,34.44 78.11,33.02 52.7,7.62 48.26,7.62 48.26,5.08 BREAKOUT1.2
PTE20
  Top 0.254: L1.4-DIN 79,38.99 78.11,38.1 78.11,14.61 78.74,13.97 78.74,3.17 78.11,2.54 58.42,2.54 57.78,3.17 57.78,7.62 57.15,8.26 41.27,8.26 BREAKOUT1.9
  Bottom 0.254: U1.9 73.66,33.94 73.66,33.02 52.7,12.06 39.37,12.06 BREAKOUT1.9
PTE21
  Bottom 0.254: U1.10 73.03,33.86 73.03,33.02 52.7,12.7 38.1,12.7 38.1,5.08 BREAKOUT1.10
PTE22
  Bottom 0.254: U1.11 72.39,33.79 72.39,33.02 52.7,13.34 36.83,13.34 BREAKOUT1.11
PTE23
  Bottom 0.254: U1.12 71.75,33.72 71.75,33.02 52.7,13.97 35.56,13.97 35.56,5.08 BREAKOUT1.12
PTE24
  Bottom 0.254: BREAKOUT1.20 25.4,5.08 25.4,14.61 29.84,19.05 52.07,19.05 62.87,29.84 62.87,33.01 U1.20
PTE25
  Bottom 0.254: U1.21 62.23,33.09 62.23,29.84 52.07,19.68 29.84,19.68 24.13,13.97 BREAKOUT1.21
PTE29  (via drill 0.5)
  Top 0.254: v66.67,33.02 74.3,33.02 75.56,34.29 J3.2
  Bottom 0.254: U1.17 65.2,33.23 | 65.2,33.23 64.77,32.8 64.77,29.84 52.07,17.14 29.84,17.14 29.21,16.51 BREAKOUT1.17 | v66.67,33.02 65.41,33.02 65.2,33.23
PTE30  (via drill 0.5)
  Top 0.254: SP1.P$2 29.84,15.88 29.21,15.24 v27.94,15.24
  Bottom 0.254: BREAKOUT1.18 27.94,5.08 v27.94,15.24 27.94,15.88 29.84,17.78 52.07,17.78 64.14,29.84 64.14,32.87 U1.18
PTE31
  Bottom 0.254: U1.19 63.5,32.94 63.5,29.84 52.07,18.41 29.84,18.41 26.67,15.24 BREAKOUT1.19
USB0_DM
  Bottom 0.254: U1.6 75.56,34.15 75.56,33.02 52.7,10.16 43.18,10.16 43.18,5.08 BREAKOUT1.6 44.45,1.91 43.81,1.27 42.55,1.27 41.91,1.91 10.16,1.91 7.62,4.45 7.62,20.95 6.75,21.83 USB.D-
USB0_DP  (via drill 0.5)
  Top 0.254: v43.18,2.54 43.18,5.08 BREAKOUT1.5
  Bottom 0.254: U1.5 76.2,34.23 76.2,33.02 52.7,9.53 44.45,9.53 BREAKOUT1.5 | v43.18,2.54 10.16,2.54 8.26,4.45 8.26,21.59 7.37,22.48 USB.D+
VCC  (via drill 0.5)  (2 unrouted)
  Top 0.254: 66.04,36.2 66.28,35.95 C4.1 68.34,35.95 v68.58,36.2 68.58,37.47 | v72.39,40.01 72.15,39.77 C2.1 70.25,39.77 68.58,38.1 68.58,37.47 | v33.02,46.35 33.02,61.59 30.48,64.14 30.48,76.2 BREAKOUT2.16 | v93.98,40.64 PD1.C 90.46,39.37 L1.1-VDD v88.64,38.99 | 89.28,38.99 v88.64,38.99 | v88.64,38.99 87.63,40.01 78.74,40.01 77.47,38.73 77.47,34.29 74.93,31.75 | 74.93,31.75 66.04,31.75 65.41,32.38 65.41,35.56 66.04,36.2 | v76.83,27.94 76.83,29.84 74.93,31.75 | LD1.A 80.64,8.89 80.01,9.53 80.01,27.3 v79.38,27.94 | J2.2 68.58,37.47 | v62.87,40.01 63.1,39.77 C3.1 | C3.1 64.14,38.1 66.04,36.2 | C3.1 65.17,39.77 66.04,40.64 66.04,43.81 66.92,44.69 C1.1 v67.31,45.72 73.03,51.44 v73.03,71.75
  Bottom 0.254: v67.31,45.72 67.31,45.94 U1.48 64.77,48.48 64.77,51.44 52.07,64.14 30.48,64.14 30.48,76.2 BREAKOUT2.16 | v72.39,40.01 72.39,39.45 U1.3 77.47,34.37 77.47,33.02 52.7,8.26 46.99,8.26 BREAKOUT1.3 | U1.13 68.58,36.19 v68.58,36.2 | BREAKOUT1.30 12.7,5.08 12.7,8.26 29.84,25.4 52.07,25.4 56.52,29.84 56.52,33.73 U1.30 62.79,40.01 v62.87,40.01 | BREAKOUT1.13 34.29,14.61 52.7,14.61 71.12,33.02 71.12,33.66 U1.13 | P1.32 32.98,46.39 v33.02,46.35 32.55,45.89 P1.31 | PD2.C v93.98,40.64 | v79.38,27.94 v76.83,27.94 | v88.64,38.99 87.63,40.01 C21.1
  other vias: 98.42,71.75
VOUT33  (via drill 0.5)
  Top 0.254: C5.1 72,36.59 v70.48,38.1 69.85,37.47 J2.1
  Bottom 0.254: 70.91,38.1 v70.48,38.1 70.91,38.1 | BREAKOUT1.7 41.91,10.79 52.7,10.79 74.93,33.02 74.93,34.08 U1.7 70.91,38.1
VREFH
  Bottom 0.254: U1.14 70.48,33.58 70.48,33.02 52.7,15.24 33.02,15.24 33.02,5.08 BREAKOUT1.14
VREFL
  Bottom 0.254: U1.15 69.85,33.5 69.85,33.02 52.7,15.88 31.75,15.88 31.75,8.89 | 31.75,8.89 BREAKOUT1.15 | J4.2 31.75,8.89
VREGIN  (via drill 0.5)
  Top 0.254: v6.35,6.99 6.35,5.71 10.16,1.91 40.01,1.91 BREAKOUT1.8
  Bottom 0.254: U1.8 74.3,34.01 74.3,33.02 52.7,11.43 40.64,11.43 40.64,5.08 BREAKOUT1.8 | v6.35,6.99 6.35,20.32 5.49,21.18 USB.VBUS

### Text on the board
tNames: 34 | 64 | 33 | 63 | Hold while powering up / to enter programming mode | USB Power | 31 | 1 | LASER RADIATION / AVOID DIRECT EYE EXPOSURE / CLASS 3R LASER PRODUCT | 32 | 2
bNames: PTA19 ** PTA20/RESET | PTB0 ** PTB1 | PTB2 ** PTB3 | PTB16 ** PTB17 | PTB18 ** PTB19 | PTC0 ** PTC1 | PTC2 ** PTC3 | PTC4 ** PTC5 | PTC6 ** PTC7 | PTC8 ** PTC9 | PTC10 ** PTC11 | PTD0 ** PTD1 | PTD2 ** PTD3 | PTD4 ** PTD5 | PTD6 ** PTD7 | VSS ** VDD | PTA4 ** PTA3/DIO | VREGIN ** VOUT33 | USB0_DM ** USB0_DP | VDD ** PTA13 | PTA12 ** PTA5 | PTA2 ** PTA1 | CLK/PTA0 ** PTE25 | PTE24 ** PTE31 | PTE30 ** PTE29 | VSSA ** VREFL | VREFH ** VDDA | PTE23 ** PTE22 | PTE21 ** PTE20 | VSS ** VDD | PTE1 ** PTE0 | PTA18 ** VSS | AHA! Badge v1